# EAGLE design matchbox_bob_v11 (EAGLE 7.4.0)
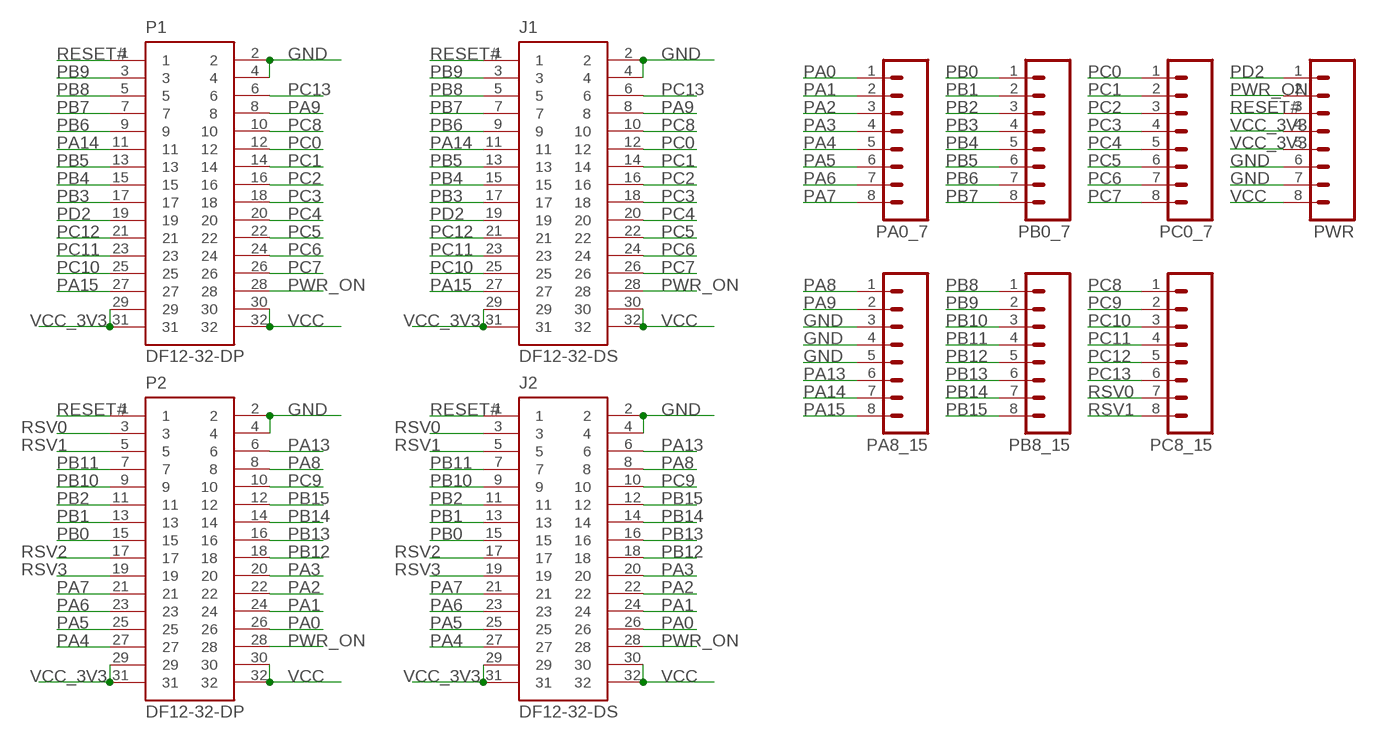
[diagram p0: schematic, sheet 1]

## Parts
J1  DF12-32-DS  AS-ITM-00012  [DF12-32-DS]
J2  DF12-32-DS  AS-ITM-00012  [DF12-32-DS]
P1  DF12-32-DP  AS-ITM-00015  [DF12-32-DP]
P2  DF12-32-DP  AS-ITM-00015  [DF12-32-DP]
PA0_7  M08FEMALE_LOCK  [1X08_FEMALE_LOCK]
PA8_15  M08FEMALE_LOCK  [1X08_FEMALE_LOCK]
PB0_7  M08FEMALE_LOCK  [1X08_FEMALE_LOCK]
PB8_15  M08FEMALE_LOCK  [1X08_FEMALE_LOCK]
PC0_7  M08FEMALE_LOCK  [1X08_FEMALE_LOCK]
PC8_15  M08FEMALE_LOCK  [1X08_FEMALE_LOCK]
PWR  M08FEMALE_LOCK  [1X08_FEMALE_LOCK]

## Nets
GND: J1.2 J1.4 J2.2 J2.4 P1.2 P1.4 P2.2 P2.4 PA8_15.3 PA8_15.4 PA8_15.5 PWR.6 PWR.7
PA0: J2.26 P2.26 PA0_7.1
PA1: J2.24 P2.24 PA0_7.2
PA2: J2.22 P2.22 PA0_7.3
PA3: J2.20 P2.20 PA0_7.4
PA4: J2.27 P2.27 PA0_7.5
PA5: J2.25 P2.25 PA0_7.6
PA6: J2.23 P2.23 PA0_7.7
PA7: J2.21 P2.21 PA0_7.8
PA8: J2.8 P2.8 PA8_15.1
PA9: J1.8 P1.8 PA8_15.2
PA13: J2.6 P2.6 PA8_15.6
PA14: J1.11 P1.11 PA8_15.7
PA15: J1.27 P1.27 PA8_15.8
PB0: J2.15 P2.15 PB0_7.1
PB1: J2.13 P2.13 PB0_7.2
PB2: J2.11 P2.11 PB0_7.3
PB3: J1.17 P1.17 PB0_7.4
PB4: J1.15 P1.15 PB0_7.5
PB5: J1.13 P1.13 PB0_7.6
PB6: J1.9 P1.9 PB0_7.7
PB7: J1.7 P1.7 PB0_7.8
PB8: J1.5 P1.5 PB8_15.1
PB9: J1.3 P1.3 PB8_15.2
PB10: J2.9 P2.9 PB8_15.3
PB11: J2.7 P2.7 PB8_15.4
PB12: J2.18 P2.18 PB8_15.5
PB13: J2.16 P2.16 PB8_15.6
PB14: J2.14 P2.14 PB8_15.7
PB15: J2.12 P2.12 PB8_15.8
PC0: J1.12 P1.12 PC0_7.1
PC1: J1.14 P1.14 PC0_7.2
PC2: J1.16 P1.16 PC0_7.3
PC3: J1.18 P1.18 PC0_7.4
PC4: J1.20 P1.20 PC0_7.5
PC5: J1.22 P1.22 PC0_7.6
PC6: J1.24 P1.24 PC0_7.7
PC7: J1.26 P1.26 PC0_7.8
PC8: J1.10 P1.10 PC8_15.1
PC9: J2.10 P2.10 PC8_15.2
PC10: J1.25 P1.25 PC8_15.3
PC11: J1.23 P1.23 PC8_15.4
PC12: J1.21 P1.21 PC8_15.5
PC13: J1.6 P1.6 PC8_15.6
PD2: J1.19 P1.19 PWR.1
PWR_ON: J1.28 J2.28 P1.28 P2.28 PWR.2
RESET#: J1.1 J2.1 P1.1 P2.1 PWR.3
RSV0: J2.3 P2.3 PC8_15.7
RSV1: J2.5 P2.5 PC8_15.8
RSV2: J2.17 P2.17
RSV3: J2.19 P2.19
VCC: J1.30 J1.32 J2.30 J2.32 P1.30 P1.32 P2.30 P2.32 PWR.8
VCC_3V3: J1.29 J1.31 J2.29 J2.31 P1.29 P1.31 P2.29 P2.31 PWR.4 PWR.5

## Library data of the parts
J1 J2 = micro1292:AS-ITM-00012: CONN RECEPT 32POS 3MM SMD 0.5MM; PARTNO: AS-ITM-00012
P1 P2 = micro1292:AS-ITM-00015: CONN HEADER 32POS 3MM SMD 0.5MM; PARTNO: AS-ITM-00015
PA0_7 PA8_15 PB0_7 PB8_15 PC0_7 PC8_15 PWR = SparkFun-Connectors:M08: Header 8 Standard 8-pin 0.1" header. Use with straight break away headers (SKU : PRT-00116), right angle break away headers (PRT-00553), swiss pins (PRT-00743), machine pins (PRT-00117), and female headers (PRT-00115).

## Board
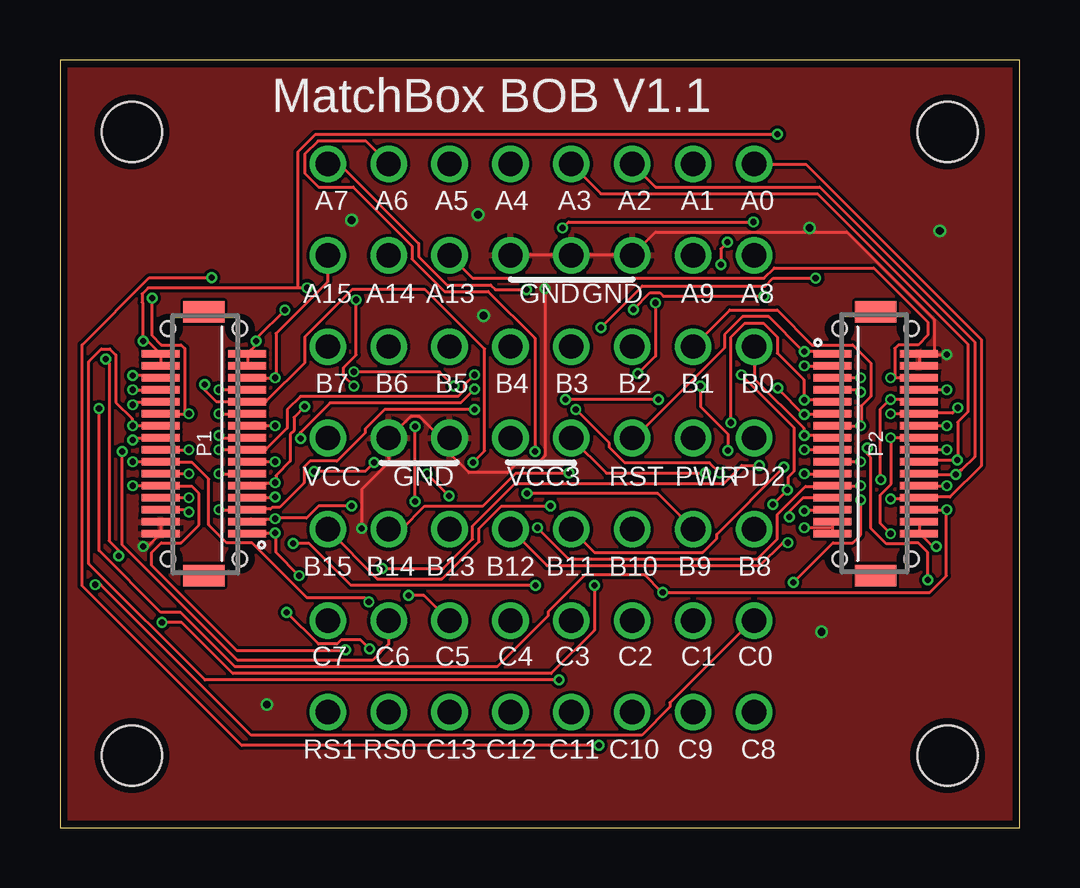
[diagram p1: board, top side]
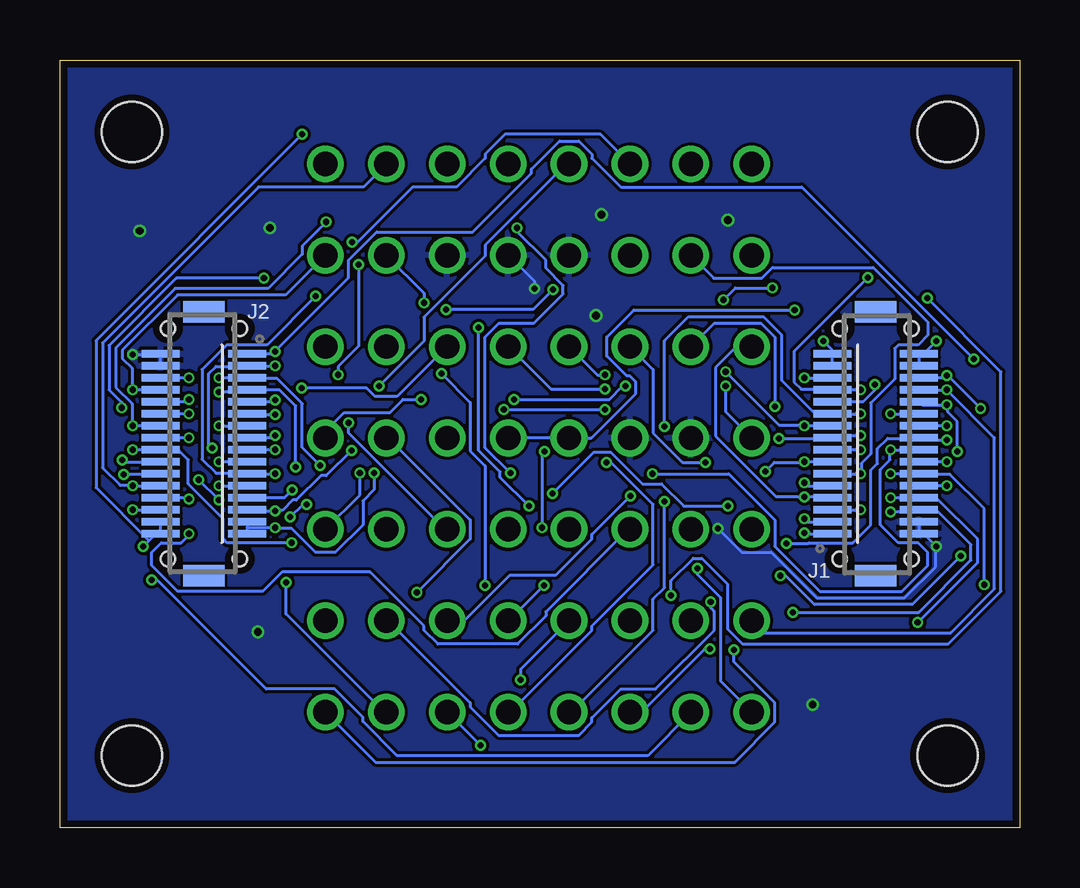
[diagram p2: board, bottom side, seen from below]

Size 40 x 32 mm. Coordinates in mm from the lower left corner, seen from the top.
Outline: 0,0 40,0 40,32 0,32 0,0
Copper layers (1*16): Top 0.0356mm / dielectric 1.5011mm / Bottom 0.0356mm
Design rules "Eagle4L *": minimum track width 5mil, minimum drill 10mil, track to track 5mil, track to pad 5mil, pad to pad 5mil, via to via 5mil, smd to smd 5mil, copper to edge 12mil, drill to drill 5mil, minimum pad ring 7mil, minimum via ring 4mil, stop-mask expansion 14mil, vias tented up to drill 14mil, thermal gap 6mil
Holes 2.5 mm at 3,29 37,29 37,3 3,3

### Footprints (pad centres in the part's own frame; a part is rotated, then mirrored left to right if it is on the bottom)
DF12-32-DS = smd 0.3 x 1.6: 1 -3.75,1.8; 2 -3.75,-1.8; 3 -3.25,1.8; 4 -3.25,-1.8; 5 -2.75,1.8; 6 -2.75,-1.8; 7 -2.25,1.8; 8 -2.25,-1.8; 9 -1.75,1.8; 10 -1.75,-1.8; 11 -1.25,1.8; 12 -1.25,-1.8; 13 -0.75,1.8; 14 -0.75,-1.8; 15 -0.25,1.8; 16 -0.25,-1.8; 17 0.25,1.8; 18 0.25,-1.8; 19 0.75,1.8; 20 0.75,-1.8; 21 1.25,1.8; 22 1.25,-1.8; 23 1.75,1.8; 24 1.75,-1.8; 25 2.25,1.8; 26 2.25,-1.8; 27 2.75,1.8; 28 2.75,-1.8; 29 3.25,1.8; 30 3.25,-1.8; 31 3.75,1.8; 32 3.75,-1.8 | smd 0.889 x 1.727: F1 -5.5,0; F2 5.5,0 | hole 0.6: -4.8,1.5; 4.8,1.5
DF12-32-DP = smd 0.3 x 1.6: 1 -3.75,-1.8; 2 -3.75,1.8; 3 -3.25,-1.8; 4 -3.25,1.8; 5 -2.75,-1.8; 6 -2.75,1.8; 7 -2.25,-1.8; 8 -2.25,1.8; 9 -1.75,-1.8; 10 -1.75,1.8; 11 -1.25,-1.8; 12 -1.25,1.8; 13 -0.75,-1.8; 14 -0.75,1.8; 15 -0.25,-1.8; 16 -0.25,1.8; 17 0.25,-1.8; 18 0.25,1.8; 19 0.75,-1.8; 20 0.75,1.8; 21 1.25,-1.8; 22 1.25,1.8; 23 1.75,-1.8; 24 1.75,1.8; 25 2.25,-1.8; 26 2.25,1.8; 27 2.75,-1.8; 28 2.75,1.8; 29 3.25,-1.8; 30 3.25,1.8; 31 3.75,-1.8; 32 3.75,1.8 | smd 0.889 x 1.727: F1 -5.5,0; F2 5.5,0 | hole 0.6: -4.8,1.5; 4.8,1.5
1X08_FEMALE_LOCK = drill 1.016: 1 0,0; 2 2.54,0; 3 5.08,0; 4 7.62,0; 5 10.16,0; 6 12.7,0; 7 15.24,0; 8 17.78,0

### Placement (x,y rotation side)
J1  6,16 90 bottom
J2  34,16 270 bottom
P1  6,16 90 top
P2  34,16 270 top
PA0_7  28.94,27.67 180 top
PA8_15  28.94,23.86 180 top
PB0_7  28.94,20.05 180 top
PB8_15  28.94,12.43 180 top
PC0_7  28.94,8.62 180 top
PC8_15  28.94,4.81 180 top
PWR  28.94,16.24 180 top

### Tracks (layer width: path | path; a pad name or v marks a point on that pad's centre or on a via)
GND  (via drill 0.25, 0.33)
  Top 0.127: P1.4 P1.2 | P1.2 | P1.4 | v3.48,11.72 3.65,11.72 4.15,12.22 P1.2 | v12.57,12.47 12.57,14.1 13.7,15.22 13.7,16.23 PWR.7 13.75,16.27 14.62,17.15 14.97,17.15 15.88,16.25 16.23,16.25 PWR.6 16.23,16.18 16.23,15.62 17.05,14.8 18.65,14.8 19.1,15.25 19.98,15.25 20.23,15.5 v20.23,22.48 | PA8_15.5 18.8,23.88 21.3,23.88 PA8_15.4 21.38,23.88 23.8,23.88 PA8_15.3 23.88,23.88 24.82,24.82 32.8,24.82 36.45,21.18 36.45,19.77 P2.2 | P2.4 35.83,19.25 35.83,19.75 P2.2 | v36.98,19.73 35.88,19.73 P2.2
  Bottom 0.127: P1.4 P1.2 | P1.2 | P1.4 | P1.2 4.15,12.22 3.98,12.22 v3.48,11.72 3.5,11.68 3.5,10.88 4.8,9.57 8.45,9.57 10.35,11.47 11.57,11.47 v12.57,12.47 | P2.4 35.83,19.25 35.83,19.75 P2.2 35.88,19.73 v36.98,19.73 | v20.23,22.48 20.23,22.77 21.3,23.85 PA8_15.4
  other vias: 31.25,25 36.67,24.88 17.65,21.35 31.75,8.15 12.15,25.32 17.43,25.55 8.62,5.12
  pour Top: 0,32 40,32 40,0 0,0
  pour Bottom: 0,32 40,32 40,0 0,0
PA0  (via drill 0.25)
  Top 0.127: v34.62,13.7 35.75,13.7 P2.26 | P2.26 | P2.26 35.85,13.78 37.1,13.78 38.4,15.07 38.4,20.35 31.1,27.65 28.95,27.65 PA0_7.1
  Bottom 0.127: P2.26 34.67,13.75 v34.62,13.7 | P2.26
PA1  (via drill 0.25)
  Top 0.127: v36.98,14.25 35.83,14.25 P2.24
  Bottom 0.127: P2.24 35.83,14.25 v36.98,14.25 37.02,14.28 37.5,14.28 38.23,15 38.23,20.2 31.73,26.7 27.35,26.7 26.4,27.65 PA0_7.2
PA2  (via drill 0.25)
  Top 0.127: P2.22 35.83,14.75 35.85,14.72 v37.35,14.72 37.4,14.75 37.55,14.9 37.58,14.9 38.12,15.45 38.12,20.25 31.68,26.7 24.82,26.7 23.88,27.65 PA0_7.3
  Bottom 0.127: v37.35,14.72 37.33,14.75 35.83,14.75 P2.22
PA3  (via drill 0.25)
  Top 0.127: P2.20 35.83,15.25 35.9,15.32 v37.4,15.32 37.42,15.38 37.42,16.9 37.85,17.32 37.85,20.15 31.57,26.43 22.55,26.43 21.32,27.65 PA0_7.4
  Bottom 0.127: v37.4,15.32 37.33,15.25 35.83,15.25 P2.20
PA4  (via drill 0.25)
  Top 0.127: v31.02,13.2 31.07,13.25 32.17,13.25 P2.27 | v27.85,15.72 27.85,16.4 26.7,17.55 v26.7,18.4
  Bottom 0.127: P2.27 32.17,13.25 32.12,13.2 v31.02,13.2 30.98,13.22 30.73,13.22 30.3,13.65 30.15,13.65 29.12,14.68 28.9,14.68 v27.85,15.72 | v26.7,18.4 24.82,20.27 24.82,21.27 22.27,23.82 22.27,24.27 18.9,27.65 18.8,27.65 PA0_7.5
PA5  (via drill 0.25)
  Top 0.127: v29.73,13.47 v30.32,14.07 30.35,14.12 30.35,14.6 30.6,14.85 30.6,16.68 v28.4,18.88 | v30.4,12.95 30.4,13.18 30.98,13.75 32.17,13.75 P2.25 | v27.55,23.48 27.55,24.12 v27.82,24.4
  Bottom 0.127: v30.32,14.07 30.65,13.75 32.17,13.75 P2.25 | v29.73,13.47 29.88,13.47 v30.4,12.95 | v28.4,18.88 28.4,19.23 27.55,20.07 v27.55,23.48 | v27.82,24.4 27.6,24.4 25.3,26.7 23.48,26.7 22.27,27.9 22.27,28.07 21.45,28.9 17.48,28.9 PA0_7.6
PA6  (via drill 0.25)
  Top 0.127: P2.23 v33.38,14.25 | P2.23 | v19.9,12.5 21.2,11.2 29.07,11.2 29.9,12.03 29.9,13.05 31.07,14.22 32.15,14.22 P2.23 | v19.8,15.68 19.8,20.4 17.85,22.35 16.02,22.35 14.68,23.7 14.68,24.25 12.22,26.7 10.78,26.7 10.2,27.27 10.2,28.07 10.75,28.62 12.75,28.62 PA0_7.7
  Bottom 0.127: v33.38,14.25 P2.23 | P2.23 | v19.9,12.5 19.9,15.57 v19.8,15.68
PA7  (via drill 0.25)
  Top 0.127: v31.02,14.75 32.17,14.75 P2.21 | v29.35,22.15 25.15,22.15 25,22.3 24.6,22.3 v23.9,21.6 | v19.45,22.43 18.15,22.43 17.95,22.62 16.12,22.62 14.95,23.8 14.95,24.35 11.65,27.65 11.18,27.65 PA0_7.8
  Bottom 0.127: v31.02,14.75 32.17,14.75 P2.21 32.25,14.78 33.5,14.78 34.08,15.35 34.08,19.1 33.05,20.12 31.38,20.12 v29.35,22.15 | v23.9,21.6 20.27,21.6 v19.45,22.43
PA8  (via drill 0.25)
  Top 0.127: v36.98,18.25 35.83,18.25 P2.8
  Bottom 0.127: P2.8 35.83,18.25 v36.98,18.25 37,18.3 37,19.15 37.4,19.55 37.4,19.9 35.1,22.2 30.6,22.2 PA8_15.1
PA9  (via drill 0.25)
  Top 0.127: v5.38,13.75 P1.8 | P1.8 | v4.25,8.55 5.08,8.55 7.2,6.42 20.48,6.42 22.27,8.22 v22.27,10.1 | v24.1,18.93 24.82,19.65 v24.82,21.88
  Bottom 0.127: P1.8 v5.38,13.75 | P1.8 | v4.25,8.55 1.75,11.05 1.75,12.03 3.45,13.72 4.15,13.72 P1.8 | v22.27,10.1 22.27,15.07 22.9,15.7 22.9,17.73 v24.1,18.93 | v24.82,21.88 24.82,22.27 PA8_15.2
PA13  (via drill 0.25)
  Top 0.127: P2.6 v34.62,18.75 34.8,18.8 34.8,19.98 34.95,20.12 35.77,20.12 36.17,20.52 36.17,21.07 33.92,23.32 29.77,23.32 29.35,22.9 17.2,22.9 PA8_15.6 | P2.6
  Bottom 0.127: v34.62,18.75 P2.6 | P2.6
PA14  (via drill 0.25)
  Top 0.127: v6.62,14.75 P1.11 | P1.11
  Bottom 0.127: P1.11 v6.62,14.75 6.6,14.8 6.6,15.18 6.2,15.57 6.2,17.7 5.2,18.7 5.2,19.98 5.05,20.12 4.22,20.12 3.83,20.52 3.83,21.07 6.1,23.35 10.3,23.35 10.75,22.9 12.75,22.9 PA8_15.7 | P1.11
PA15  (via drill 0.25)
  Top 0.127: P1.27 7.83,18.75 v8.97,18.75 9,18.8 9,20.6 11.15,22.75 PA8_15.8
  Bottom 0.127: v8.97,18.75 7.83,18.75 P1.27
PB0  (via drill 0.25)
  Top 0.127: P2.15 32.17,16.25 32.08,16.35 v31.02,16.35 31,16.4 31,16.65 28.95,18.7 PB0_7.1
  Bottom 0.127: v31.02,16.35 31.12,16.25 32.17,16.25 P2.15
PB1  (via drill 0.25)
  Top 0.127: P2.13 v33.38,16.75 33.4,16.8 33.4,17.57 33.8,17.98 33.8,19.38 33.05,20.12 31.35,20.12 29.9,21.57 27.93,21.57 PB0_7.2 | P2.13
  Bottom 0.127: v33.38,16.75 P2.13 | P2.13
PB2  (via drill 0.25)
  Top 0.127: P2.11 32.17,17.25 31.05,17.25 v31.02,17.23 30.98,17.25 29.93,18.3 v29.93,18.32
  Bottom 0.127: v31.02,17.23 32.15,17.23 32.17,17.25 P2.11 | v29.93,18.32 27.23,18.32 26.88,17.98 25.95,17.98 23.88,20.05 PB0_7.3
PB3  (via drill 0.25)
  Top 0.127: P1.17 6.72,16.25 v6.62,16.35 | P1.17 | v10.03,16.23 10.03,16.48 11.25,17.7 16.7,17.7 v17.27,18.27
  Bottom 0.127: v6.62,16.35 7.7,16.35 P1.17 | P1.17 | v10.03,16.23 7.85,16.23 P1.17 | v17.27,18.27 19.52,18.27 21.3,20.05 PB0_7.4
PB4  (via drill 0.25)
  Top 0.127: P1.15 v6.62,15.75 | P1.15 | v17.27,18.88 16.85,18.45 16.85,18.23 16.6,17.98 10.03,17.98 9.47,17.43 9.47,16.65 8.6,15.78 7.85,15.78 P1.15
  Bottom 0.127: v6.62,15.75 P1.15 | P1.15 | v17.27,18.88 17.6,18.88 PB0_7.5
PB5  (via drill 0.25)
  Top 0.127: v8.97,15.25 7.83,15.25 P1.13 | v10.6,14.85 12.72,14.85 v13.1,15.22
  Bottom 0.127: P1.13 7.83,15.25 v8.97,15.25 9.03,15.22 10.22,15.22 v10.6,14.85 | v13.1,15.22 14.05,15.22 15.28,16.45 15.28,19.1 16.23,20.05 PB0_7.6
PB6  (via drill 0.25)
  Top 0.127: P1.9 7.83,14.25 7.95,14.38 v8.97,14.38 9,14.43 9,14.68 9.6,15.28 9.6,16.4 9.75,16.55 9.75,17.1 v10.2,17.55
  Bottom 0.127: v8.97,14.38 8.85,14.25 7.83,14.25 P1.9 | v10.2,17.55 10.2,20.45 10.78,21.02 12.72,21.02 PB0_7.7
PB7  (via drill 0.25)
  Top 0.127: v8.97,13.78 8.95,13.75 7.83,13.75 P1.7
  Bottom 0.127: P1.7 7.83,13.75 7.85,13.78 v8.97,13.78 9.03,13.8 10.15,13.8 12.68,16.32 12.68,19.18 11.8,20.05 11.18,20.05 PB0_7.8
PB8  (via drill 0.25)
  Top 0.127: v6.62,13.25 P1.5 | P1.5 | v17.27,17.43 13.53,17.43 12.72,16.62 12.72,16.45 11.55,15.28 10.43,15.28 10.18,15.03 10.18,14.38 9.15,13.35 8.85,13.35 8.78,13.28 7.85,13.28 P1.5 | v21.5,17.43 22.9,16.02 22.9,15.85 23.55,15.2 27.07,15.2 v27.5,14.78
  Bottom 0.127: P1.5 v6.62,13.25 | P1.5 | v21.5,17.43 v17.27,17.43 | v27.5,14.78 27.5,13.88 28.93,12.45 PB8_15.1
PB9  (via drill 0.25)
  Top 0.127: P1.3 7.83,12.75 7.95,12.88 v8.97,12.88 9.03,12.9 10.28,12.9 10.78,13.4 v12.15,13.4 | v19.48,13.93 24.93,13.93 26.4,12.45 PB8_15.2
  Bottom 0.127: v8.97,12.88 8.85,12.75 7.83,12.75 P1.3 | v12.15,13.4 14,13.4 14.93,14.32 15.72,14.32 17.05,15.65 17.75,15.65 v19.48,13.93
PB10  (via drill 0.25)
  Top 0.127: P2.9 32.17,17.75 32.1,17.82 v31.02,17.82 31,17.88 31,18.68 29.9,19.77 29.9,20.45 29.32,21.02 28.55,21.02 27.98,20.45 v27.98,16.88
  Bottom 0.127: v31.02,17.82 31.1,17.75 32.17,17.75 P2.9 | v27.98,16.88 27.98,16.45 23.98,12.45 23.88,12.45 PB8_15.3
PB11  (via drill 0.25)
  Top 0.127: P2.7 33.27,18.25 v33.38,18.15 | P2.7 | v30.18,15.03 27.38,12.22 27.38,12.05 26.8,11.47 22.27,11.47 PB8_15.4
  Bottom 0.127: v33.38,18.15 32.3,18.15 P2.7 | P2.7 | v30.18,15.03 30.18,17.57 30.85,18.25 32.15,18.25 P2.7
PB12  (via drill 0.25)
  Top 0.127: v36.98,15.75 35.83,15.75 P2.18 | v30.35,11.88 30.12,11.88 29.18,10.93 20.3,10.93 18.8,12.43 PB8_15.5
  Bottom 0.127: v36.98,15.75 35.83,15.75 P2.18 35.75,15.72 35.05,15.72 34.65,15.32 34.65,14.32 33.2,12.88 33.2,12.03 33.05,11.88 v30.35,11.88
PB13  (via drill 0.25)
  Top 0.127: P2.16 v34.62,16.25 34.65,16.2 34.65,14.32 34.2,13.88 34.2,12.68 v34.62,12.25 | P2.16
  Bottom 0.127: v34.62,16.25 P2.16 | P2.16 | v34.62,12.25 34.62,12.2 34.95,11.88 35.77,11.88 36.17,11.47 36.17,10.93 35.1,9.85 31.55,9.85 30.75,10.65 27.07,10.65 24.82,8.4 24.82,8.22 24.25,7.65 20.93,7.65 19.75,8.82 19.75,9 16.32,12.43 PB8_15.6
PB14  (via drill 0.25)
  Top 0.127: v36.98,16.75 35.83,16.75 P2.14 | v28.9,25.25 21.2,25.25 v20.95,25 | v21.23,14.78 19,14.78 17.62,13.4 15.2,13.4 14.25,12.45 13.7,12.45 PB8_15.7
  Bottom 0.127: P2.14 35.83,16.75 v36.98,16.75 37,16.8 37,17.68 37.67,18.35 37.67,20 35.2,22.48 31.32,22.48 29.9,23.9 29.9,24.25 v28.9,25.25 | v20.95,25 20.95,24.85 19.75,23.65 19.75,23.32 19.02,22.6 19.02,22.25 20.25,21.02 21.7,21.02 22.27,20.45 22.27,15.82 v21.23,14.78
PB15  (via drill 0.25)
  Top 0.127: P2.12 v34.62,17.25 | P2.12 | v37.42,17.5 37.2,17.27 35.85,17.27 P2.12 | v31.5,22.9 29.73,22.9 29.4,22.57 24.27,22.57 v22.55,20.85 | v20.45,13.4 18.4,13.4 17.48,12.47 17.48,11.93 15.93,10.38 13.22,10.38 11.18,12.43 PB8_15.8
  Bottom 0.127: v34.62,17.25 P2.12 | P2.12 | v37.42,17.5 37.42,17.73 37.95,18.25 37.95,20.1 35.15,22.9 v31.5,22.9 | v22.55,20.85 22.55,15.72 21.65,14.82 21.65,14.6 v20.45,13.4
PC0  (via drill 0.25)
  Top 0.127: v5.38,14.75 P1.12 | P1.12 | v1.48,10.12 1.7,10.12 7.97,3.85 24.25,3.85 25.43,5.03 25.43,5.2 28.82,8.6 28.93,8.6 PC0_7.1
  Bottom 0.127: P1.12 v5.38,14.75 | P1.12 | v1.48,10.12 1.48,13.3 2.9,14.72 4.15,14.72 P1.12
PC1  (via drill 0.25)
  Top 0.127: v3.02,15.25 4.17,15.25 P1.14 4.25,15.22 5.5,15.22 6.2,14.53 6.2,12.62 6.95,11.88 8,11.88 10.3,9.57 12.7,9.57 v12.88,9.4
  Bottom 0.127: v3.02,15.25 4.17,15.25 P1.14 | v12.88,9.4 12.88,9.15 12.72,9 12.72,8.22 15.18,5.78 16.62,5.78 17.82,4.58 17.82,4.4 18.38,3.85 21.73,3.85 22.9,5.03 22.9,5.2 26.3,8.6 26.4,8.6 PC0_7.2
PC2  (via drill 0.25)
  Top 0.127: P1.16 v5.38,15.75 | P1.16 | v16.23,13.82 v15.3,14.75
  Bottom 0.127: P1.16 v5.38,15.75 5.4,15.7 5.4,15.32 5.8,14.93 5.8,12.62 5.05,11.88 4.22,11.88 3.83,11.47 3.83,10.93 4.9,9.85 8.32,9.85 10.2,11.72 10.2,12.82 12.12,14.75 v15.3,14.75 | P1.16 | v16.23,13.82 17.82,12.22 17.82,12.03 19.32,10.53 21.25,10.53 23.15,8.62 PC0_7.3
PC3  (via drill 0.25)
  Top 0.127: v3.02,16.15 3.12,16.25 4.17,16.25 P1.18 | v9.72,11.85 10.38,11.85 12.12,10.1 v19.82,10.1
  Bottom 0.127: v3.02,16.15 4.08,16.15 4.17,16.25 P1.18 4.25,16.23 5.5,16.23 5.92,15.8 5.92,15.18 6.2,14.9 6.2,12.62 6.95,11.88 8.78,11.88 8.8,11.85 v9.72,11.85 | v19.82,10.1 21.3,8.62 PC0_7.4
PC4  (via drill 0.25)
  Top 0.127: P1.20 4.17,16.75 v3.02,16.75 3,16.8 3,17.05 2.33,17.73 2.33,19.7 2.08,19.95 1.73,19.95 1.2,19.43 1.2,11 6.05,6.15 v20.8,6.15
  Bottom 0.127: v3.02,16.75 4.17,16.75 P1.20 | v20.8,6.15 20.8,6.6 18.8,8.6 PC0_7.5
PC5  (via drill 0.25)
  Top 0.127: P1.22 v5.38,17.25 5.2,17.3 5.2,19.98 5.05,20.12 4.22,20.12 3.83,20.52 3.83,22.05 v3.85,22.07 | P1.22 | v14.53,9.68 15.18,9.68 16.23,8.62 PC0_7.6
  Bottom 0.127: v5.38,17.25 P1.22 | P1.22 | v3.85,22.07 0.78,19 0.78,9.85 2.98,7.65 11.55,7.65 12.18,8.28 12.18,10.15 13.25,11.22 13.6,11.22 14.53,10.3 v14.53,9.68
PC6  (via drill 0.25)
  Top 0.127: v3.02,17.62 3.15,17.75 4.17,17.75 P1.24 | v2.6,15.68 2.6,11.78 7.4,6.97 13.03,6.97 13.7,7.65 13.7,8.6 PC0_7.7
  Bottom 0.127: P1.24 4.17,17.75 4.05,17.62 v3.02,17.62 3,17.57 3,17.32 2.6,16.93 v2.6,15.68
PC7  (via drill 0.25)
  Top 0.127: v3.02,18.25 4.17,18.25 P1.26
  Bottom 0.127: P1.26 4.17,18.25 v3.02,18.25 3,18.2 1.05,16.25 1.05,9.95 2.88,8.12 10.68,8.12 11.15,8.6 PC0_7.8
PC8  (via drill 0.25)
  Top 0.127: v3.02,14.25 4.17,14.25 P1.10 4.25,14.22 5.5,14.22 5.8,13.93 5.8,12.62 5.05,11.88 4.22,11.88 3.83,11.47 3.83,10.93 7.38,7.38 11.88,7.38 v11.9,7.4
  Bottom 0.127: v3.02,14.25 4.17,14.25 P1.10 | v11.9,7.4 11.9,6.9 10.2,5.2 10.2,4.4 11.88,2.73 26.85,2.73 28.93,4.8 PC8_15.1
PC9  (via drill 0.25)
  Top 0.127: P2.10 35.7,17.85 v34.62,17.85 34.58,17.82 34.2,17.45 34.2,14.53 v34.23,14.5 | P2.10 | v33.38,13.65 33.38,12.2 33.05,11.88 32.23,11.88 v30.57,10.22
  Bottom 0.127: P2.10 34.73,17.75 v34.62,17.85 | P2.10 | v33.38,13.65 v34.23,14.5 | v30.57,10.22 30.57,8.9 26.5,4.83 26.4,4.83 PC8_15.2
PC10  (via drill 0.25)
  Top 0.127: P1.25 v6.62,18.25 | P1.25 | v6.33,22.93 3.73,22.93 0.93,20.12 0.93,10.07 7.58,3.42 v22.48,3.42
  Bottom 0.127: v6.62,18.25 P1.25 | P1.25 | v6.33,22.93 9.4,19.85 9.4,18.57 9.1,18.27 7.85,18.27 P1.25 | v22.48,3.42 PC8_15.3
PC11  (via drill 0.25)
  Top 0.127: v6.03,18.48 6.03,18.25 6.53,17.75 P1.23 | P1.23 | v17.23,15.22 17.7,15.7 17.7,19.95 15.22,22.43 12.18,22.43 10.2,20.45 10.2,19.38 8.6,17.77 7.85,17.77 P1.23
  Bottom 0.127: P1.23 6.53,17.75 6.03,18.25 v6.03,18.48 | P1.23 | v17.23,15.22 17.02,15.22 15.28,13.47 15.28,10.95 17.82,8.4 17.82,8.22 21.23,4.83 21.3,4.83 PC8_15.4
PC12  (via drill 0.25)
  Top 0.127: v6.62,17.25 P1.21 | P1.21 | v14.8,13.6 v14.8,16.73
  Bottom 0.127: P1.21 v6.62,17.25 | P1.21 | v14.8,16.73 14.8,20.3 13.8,21.3 10.68,21.3 9.93,20.55 9.93,18.65 8.55,17.27 7.85,17.27 P1.21 | v14.8,13.6 14.8,10 15.28,9.53 15.28,8.22 18.68,4.83 18.77,4.83 PC8_15.5
PC13  (via drill 0.25)
  Top 0.127: P1.6 5.28,13.25 v5.38,13.15 | P1.6 | v9.45,8.97 10.78,7.65 11.55,7.65 11.72,7.83 12.53,7.83 v12.9,7.45
  Bottom 0.127: v5.38,13.15 4.3,13.15 P1.6 | P1.6 | v9.45,8.97 4.2,8.97 2.02,11.15 2.02,11.8 3.45,13.22 4.15,13.22 P1.6 | v12.9,7.45 13.12,7.45 15.75,4.83 16.23,4.83 PC8_15.6
PD2  (via drill 0.25)
  Top 0.127: v8.97,16.75 7.83,16.75 P1.19 | v12.25,19 15.82,19 v16.43,18.4 | v24.95,17.85 v21.07,17.85
  Bottom 0.127: P1.19 7.83,16.75 v8.97,16.75 9.03,16.77 10.03,16.77 v12.25,19 | v16.43,18.4 16.55,18.4 17.1,17.85 v21.07,17.85 | v24.95,17.85 25.7,17.85 26.25,17.3 28.15,17.3 28.93,16.52 28.93,16.25 PWR.1
PWR_ON  (via drill 0.25)
  Top 0.127: v3.02,18.85 4.08,18.85 4.17,18.75 P1.28 | P2.28 35.83,13.25 v36.98,13.25 36.95,13.2 36.95,10.5 36.25,9.8 v25.12,9.8 25.07,9.82 24.38,10.53 21.88,10.53 20.35,9 20.35,8.82 18.23,6.7 7.3,6.7 5.03,8.97 4.2,8.97 1.62,11.55 v1.62,17.48
  Bottom 0.127: P1.28 4.17,18.75 3.12,18.75 v3.02,18.85 2.98,18.82 v1.62,17.48 | v36.98,13.25 35.83,13.25 P2.28 | v25.12,9.8 22.9,12.03 22.9,12.82 26.3,16.23 26.4,16.23 PWR.2
RESET#  (via drill 0.25)
  Top 0.127: P1.1 7.83,12.25 7.85,12.28 v8.97,12.28 9,12.22 9,11.47 v9.97,10.5 | P2.1 32.17,19.75 32.08,19.85 v31.02,19.85 30.98,19.88 29.55,21.3 28.45,21.3 27.7,20.55 27.7,20 23.95,16.25 23.88,16.25 PWR.3 | v2.45,11.32 2.45,11.55 2.05,11.95 2.05,19.38 v1.9,19.52
  Bottom 0.127: v8.97,12.28 8.95,12.25 7.83,12.25 P1.1 | P2.1 32.17,19.75 31.12,19.75 v31.02,19.85 31,19.9 27.98,22.93 27.98,23.65 26.8,24.82 22.8,24.82 20.35,27.27 20.35,27.45 19.18,28.62 18.38,28.62 17.82,28.07 17.82,27.9 16.62,26.7 9.07,26.7 v1.9,19.52 | v9.97,10.5 9.75,10.5 8.55,9.3 4.47,9.3 v2.45,11.32
RSV0  (via drill 0.25)
  Top 0.127: v31.02,19.25 32.17,19.25 P2.3 | v33.65,15.82 33.65,15.57 33.8,15.43 33.8,12.47 34.45,11.82 35.25,11.82 35.3,11.88 35.77,11.88 36.17,11.47 v36.17,10.32
  Bottom 0.127: v31.02,19.25 32.17,19.25 P2.3 32.25,19.23 33.5,19.23 33.8,18.93 33.8,15.97 v33.65,15.82 | v36.17,10.32 35.95,10.32 31.4,5.78 28.55,5.78 27.38,4.6 27.38,4.42 25.95,3 15.5,3 PC8_15.7
RSV1  (via drill 0.25)
  Top 0.127: v33.38,18.75 P2.5 | P2.5 | v29.15,15.1 28.43,15.1 27.68,14.35 18.98,14.35 17.2,12.57 17.2,12.03 15.97,10.8 v13.43,10.8
  Bottom 0.127: P2.5 v33.38,18.75 | P2.5 | v29.15,15.1 29.9,15.85 29.9,17.68 30.95,18.73 32.15,18.73 P2.5 | v13.43,10.8 13.43,10.55 12.45,9.57 12.45,6.1 11.18,4.83 PC8_15.8
RSV2  (via drill 0.25)
  Top 0.127: v31.02,15.75 32.17,15.75 J2.17
  Bottom 0.127: v31.02,15.75 32.17,15.75 J2.17
RSV3  (via drill 0.25)
  Top 0.127: v33.38,15.25 J2.19 | J2.19
  Bottom 0.127: J2.19 v33.38,15.25 | J2.19
VCC  (via drill 0.25)
  Top 0.127: P2.30 35.83,12.75 35.83,12.25 P2.32 35.88,12.22 36.38,11.72 v36.52,11.72 | P1.32 P1.30 | P1.30 | P1.32 | P1.32 4.15,19.77 3.65,20.27 v3.48,20.27 3.45,20.32 3.45,21.88 3.42,21.9 3.42,22.25 3.67,22.5 9.93,22.5 | v10.3,22.5 9.93,22.5 | v12.35,22 12.35,19.7 11.82,19.18 11.82,18.82 v12.25,18.4 | v29.9,28.9 10.65,28.9 9.93,28.18 9.93,22.55 9.93,22.5
  Bottom 0.127: P2.30 35.83,12.75 35.83,12.25 P2.32 35.88,12.22 36.02,12.22 36.29,11.96 | v36.52,11.72 36.29,11.96 | P1.32 P1.30 | P1.30 | P1.32 | v3.48,20.27 3.98,19.77 4.15,19.77 P1.32 | v10.3,22.5 11.85,22.5 v12.35,22 | v12.25,18.4 12.25,17.32 11.18,16.25 PWR.8 | v29.9,28.9 38.5,20.3 38.5,14.18 36.33,12 36.29,11.96
VCC_3V3  (via drill 0.25)
  Top 0.127: P2.29 32.2,12.5 | 32.2,12.5 P2.31 | P2.31 | P2.29 | v31.02,12.5 32.15,12.5 32.2,12.5 | v26.9,14.78 22.77,14.78 21.32,16.23 PWR.4 | P1.29 7.83,19.25 7.83,19.75 P1.31 7.85,19.8 8.18,20.12 v8.18,20.27 8.2,20.32 8.2,20.4 v9.38,21.57
  Bottom 0.127: P2.29 32.2,12.5 | 32.2,12.5 P2.31 | P2.31 | P2.29 | 32.2,12.5 32.15,12.5 v31.02,12.5 30.98,12.47 30.35,12.47 29.35,11.47 28.52,11.47 27.38,12.62 27.38,13.62 26.9,14.1 v26.9,14.78 | P1.29 7.83,19.25 7.83,19.75 P1.31 7.85,19.8 7.85,19.95 v8.18,20.27 | v9.38,21.57 16.07,21.57 17.2,20.45 17.2,19.65 16.38,18.82 16.25,18.82 16,18.57 16,18.1 17.85,16.25 PWR.5 18.82,16.25 21.3,16.25 PWR.4

### Text on the board
tPlace: A7 | A6 | A5 | A5 | A4 | A3 | A2 | A1 | A0 | A15 | A14 | A13 | GND | GND | A9 | A8 | B7 | B6 | B5 | B4 | B3 | B2 | B1 | B0 | VCC | GND | VCC3 | RST | PWR | PD2 | B15 | B14 | B13 | B12 | B11 | B10 | B9 | B8 | C7 | C6 | C5 | C4 | C3 | C2 | C1 | C0 | RS1 | RS0 | C13 | C12 | C11 | C10 | C9 | C8
tNames: MatchBox BOB V1.1